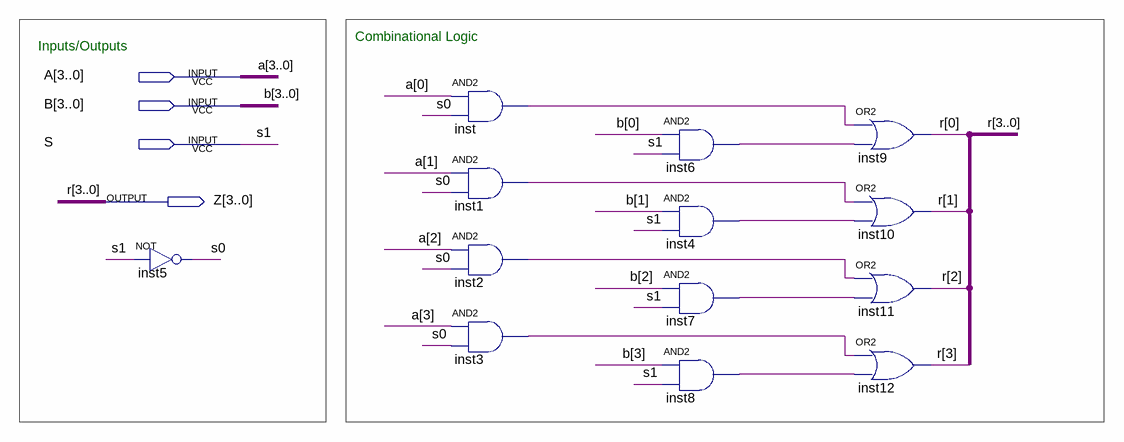
[diagram p0: schematic sheet]
// Quartus schematic mux_8bits_4bits.bdf as structural Verilog: 13 symbols, 4 pins
module mux_8bits_4bits (
  input  [3:0] A,
  input  [3:0] B,
  input  S,
  output [3:0] Z
);

  wire inst1_out, inst2_out, inst3_out, inst4_out, inst6_out, inst7_out, inst8_out, inst_out, s0;

  not inst5 (s0, S);
  and inst (inst_out, A[0], s0);
  and inst1 (inst1_out, A[1], s0);
  and inst2 (inst2_out, A[2], s0);
  and inst3 (inst3_out, A[3], s0);
  and inst6 (inst6_out, B[0], S);
  and inst4 (inst4_out, B[1], S);
  and inst7 (inst7_out, B[2], S);
  and inst8 (inst8_out, B[3], S);
  or inst9 (Z[0], inst_out, inst6_out);
  or inst10 (Z[1], inst1_out, inst4_out);
  or inst11 (Z[2], inst2_out, inst7_out);
  or inst12 (Z[3], inst3_out, inst8_out);

  // Other names for the same wires on the sheet: r[3:0] = Z; s1 = S

  // Notes on the sheet:
  //   Combinational Logic
  //   Inputs/Outputs
endmodule
